# Altium schematic sheet MOSFET.SchDoc
size 149 x 100 mm
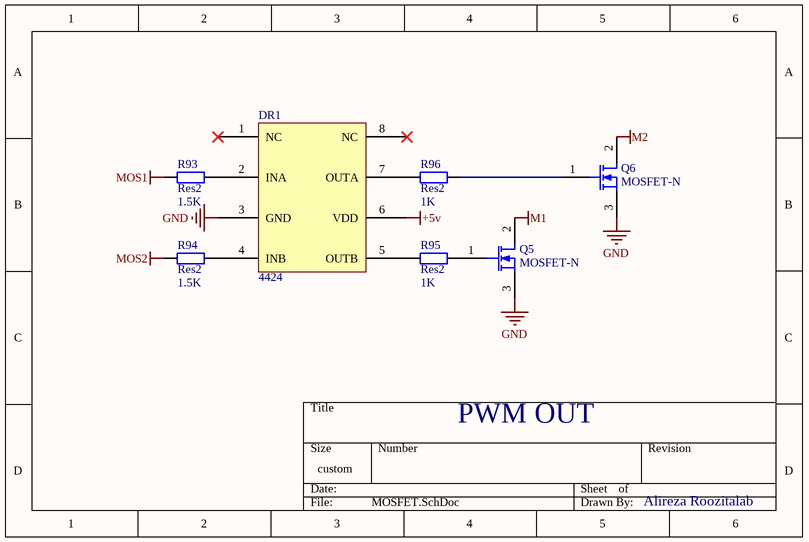
[diagram p0: MOSFET.SchDoc]

## Parts
DR1  4424  [SOP8]
Q5  MOSFET-N  [dpak-to252]
Q6  MOSFET-N  [dpak-to252]
R93  Res2  value 1.5K  [RES 1206 (3216X08L)]
R94  Res2  value 1.5K  [RES 1206 (3216X08L)]
R95  Res2  value 1K  [RES 1206 (3216X08L)]
R96  Res2  value 1K  [RES 1206 (3216X08L)]

## Nets
+5v: DR1.6(VDD)
GND: DR1.3(GND) Q5.3(S) Q6.3(S)
M1: Q5.2(D)
M2: Q6.2(D)
MOS1: R93.1
MOS2: R94.1
NetDR1_2: DR1.2(INA) R93.2
NetDR1_4: DR1.4(INB) R94.2
NetDR1_5: DR1.5(OUTB) R95.1
NetDR1_7: DR1.7(OUTA) R96.1
NetQ5_1: Q5.1(G) R95.2
NetQ6_1: Q6.1(G) R96.2

Not connected (* = marked no-connect by the designer): DR1 1(NC)* 8(NC)*

## Notes on the sheet
- PWM OUT
- Alireza Roozitalab

## Library data of the parts
Q5 Q6 = MOSFET-N: N-Channel MOSFET; PackageDocument: 1995/1996; Published: 8-Jun-2000; LatestRevisionDate: 17-Jul-2002; LatestRevisionNote: Re-released for DXP Platform.; PackageReference: E3; Publisher: Altium Limited
R93-R96 = Res2: Resistor; Published: 8-Jun-2000; LatestRevisionDate: 17-Jul-2002; LatestRevisionNote: Re-released for DXP Platform.; PackageReference: AXIAL-0.4; Publisher: Altium Limited